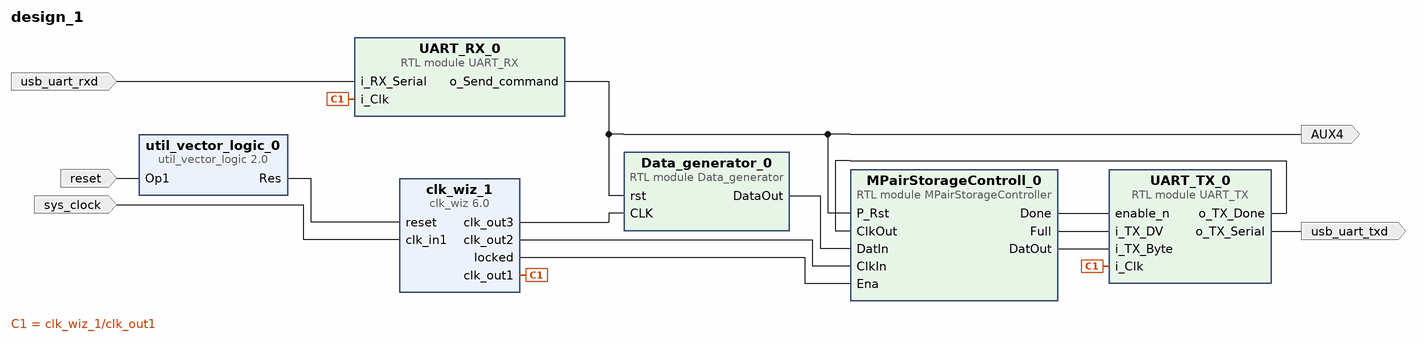
[diagram p0: block diagram of the top level]
# Vivado block design design_1, xc7a35tcsg324-2, Vivado 2019.1
create_bd_design design_1

create_bd_port -dir I -type rst reset
set_property -dict {CONFIG.POLARITY ACTIVE_LOW} [get_bd_ports reset]
create_bd_port -dir I -type clk sys_clock
set_property -dict {CONFIG.FREQ_HZ 100000000 CONFIG.PHASE 0.000} [get_bd_ports sys_clock]
create_bd_port -dir I usb_uart_rxd
create_bd_port -dir O usb_uart_txd
create_bd_port -dir O AUX4

create_bd_cell -type ip -vlnv xilinx.com:ip:clk_wiz:6.0 clk_wiz_1
set_property -dict [list \
  CONFIG.CLKOUT1_JITTER 114.829 \
  CONFIG.CLKOUT1_REQUESTED_OUT_FREQ 200.000 \
  CONFIG.CLKOUT2_JITTER 159.371 \
  CONFIG.CLKOUT2_PHASE_ERROR 98.575 \
  CONFIG.CLKOUT2_REQUESTED_OUT_FREQ 40.000 \
  CONFIG.CLKOUT2_USED true \
  CONFIG.CLKOUT3_JITTER 159.371 \
  CONFIG.CLKOUT3_PHASE_ERROR 98.575 \
  CONFIG.CLKOUT3_REQUESTED_OUT_FREQ 40.000 \
  CONFIG.CLKOUT3_REQUESTED_PHASE 90 \
  CONFIG.CLKOUT3_USED true \
  CONFIG.CLK_IN1_BOARD_INTERFACE sys_clock \
  CONFIG.MMCM_CLKOUT0_DIVIDE_F 5.000 \
  CONFIG.MMCM_CLKOUT1_DIVIDE 25 \
  CONFIG.MMCM_CLKOUT2_DIVIDE 25 \
  CONFIG.MMCM_CLKOUT2_PHASE 90.000 \
  CONFIG.NUM_OUT_CLKS 3 \
  CONFIG.RESET_BOARD_INTERFACE reset \
  CONFIG.RESET_PORT reset \
  CONFIG.RESET_TYPE ACTIVE_HIGH \
  CONFIG.USE_BOARD_FLOW true \
] [get_bd_cells clk_wiz_1]
create_bd_cell -type ip -vlnv xilinx.com:ip:util_vector_logic:2.0 util_vector_logic_0
set_property -dict {CONFIG.C_OPERATION not CONFIG.C_SIZE 1} [get_bd_cells util_vector_logic_0]
create_bd_cell -type module -reference UART_TX UART_TX_0
set_property -dict {CONFIG.g_CLKS_PER_BIT 25 CONFIG.width 12} [get_bd_cells UART_TX_0]
create_bd_cell -type module -reference UART_RX UART_RX_0
set_property -dict {CONFIG.Bytes_num 2 CONFIG.g_CLKS_PER_BIT 25} [get_bd_cells UART_RX_0]
create_bd_cell -type module -reference MPairStorageController MPairStorageControll_0
set_property -dict {CONFIG.record_delay 10 CONFIG.rep_delay 6000 CONFIG.width 12} [get_bd_cells MPairStorageControll_0]
create_bd_cell -type module -reference Data_generator Data_generator_0

# ---- connections ----

connect_bd_net [get_bd_pins clk_wiz_1/clk_out1] [get_bd_pins UART_TX_0/i_Clk] [get_bd_pins UART_RX_0/i_Clk]
connect_bd_net [get_bd_ports sys_clock] [get_bd_pins clk_wiz_1/clk_in1]
connect_bd_net [get_bd_ports reset] [get_bd_pins util_vector_logic_0/Op1]
connect_bd_net [get_bd_pins util_vector_logic_0/Res] [get_bd_pins clk_wiz_1/reset]
connect_bd_net [get_bd_ports usb_uart_rxd] [get_bd_pins UART_RX_0/i_RX_Serial]
connect_bd_net [get_bd_pins UART_RX_0/o_Send_command] \
  [get_bd_ports AUX4] [get_bd_pins MPairStorageControll_0/P_Rst] [get_bd_pins Data_generator_0/rst]
connect_bd_net [get_bd_pins UART_TX_0/o_TX_Done] [get_bd_pins MPairStorageControll_0/ClkOut]
connect_bd_net [get_bd_pins UART_TX_0/o_TX_Serial] [get_bd_ports usb_uart_txd]
connect_bd_net [get_bd_pins clk_wiz_1/clk_out2] [get_bd_pins MPairStorageControll_0/ClkIn]
connect_bd_net [get_bd_pins clk_wiz_1/locked] [get_bd_pins MPairStorageControll_0/Ena]
connect_bd_net [get_bd_pins MPairStorageControll_0/Done] [get_bd_pins UART_TX_0/enable_n]
connect_bd_net [get_bd_pins MPairStorageControll_0/Full] [get_bd_pins UART_TX_0/i_TX_DV]
connect_bd_net [get_bd_pins MPairStorageControll_0/DatOut] [get_bd_pins UART_TX_0/i_TX_Byte]
connect_bd_net [get_bd_pins clk_wiz_1/clk_out3] [get_bd_pins Data_generator_0/CLK]
connect_bd_net [get_bd_pins Data_generator_0/DataOut] [get_bd_pins MPairStorageControll_0/DatIn]

validate_bd_design
save_bd_design
